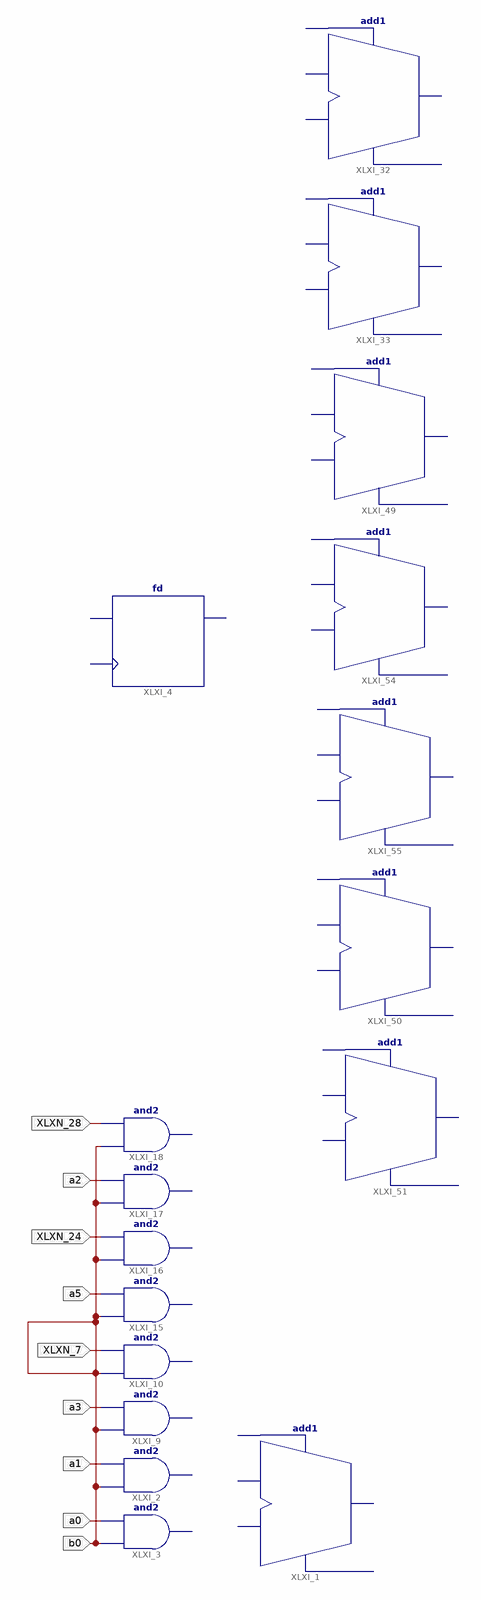
[diagram p0: schematic sheet 1]
// Xilinx ISE schematic scheme_main.sch (xc9500xl) as structural Verilog: 17 symbols, 9 ports
module scheme_main (
  input  XLXN_24,
  input  XLXN_28,
  input  b0,
  input  a2,
  input  a5,
  input  a3,
  input  XLXN_7,
  input  a0,
  input  a1
);

  fd XLXI_4 ();  // open: C, D, Q
  add1 XLXI_1 ();  // open: A0, B0, CI, CO, S0
  // and2 XLXI_18 has open pins: I0=b0, I1=XLXN_28, O=open
  // and2 XLXI_17 has open pins: I0=b0, I1=a2, O=open
  // and2 XLXI_16 has open pins: I0=b0, I1=XLXN_24, O=open
  // and2 XLXI_15 has open pins: I0=b0, I1=a5, O=open
  // and2 XLXI_10 has open pins: I0=b0, I1=XLXN_7, O=open
  // and2 XLXI_9 has open pins: I0=b0, I1=a3, O=open
  // and2 XLXI_2 has open pins: I0=b0, I1=a1, O=open
  // and2 XLXI_3 has open pins: I0=b0, I1=a0, O=open
  add1 XLXI_32 ();  // open: A0, B0, CI, CO, S0
  add1 XLXI_33 ();  // open: A0, B0, CI, CO, S0
  add1 XLXI_49 ();  // open: A0, B0, CI, CO, S0
  add1 XLXI_54 ();  // open: A0, B0, CI, CO, S0
  add1 XLXI_55 ();  // open: A0, B0, CI, CO, S0
  add1 XLXI_50 ();  // open: A0, B0, CI, CO, S0
  add1 XLXI_51 ();  // open: A0, B0, CI, CO, S0
endmodule
